# Altium schematic sheet ETHERNET.SchDoc
size A; SheetNumber: 10; SheetTotal: 10
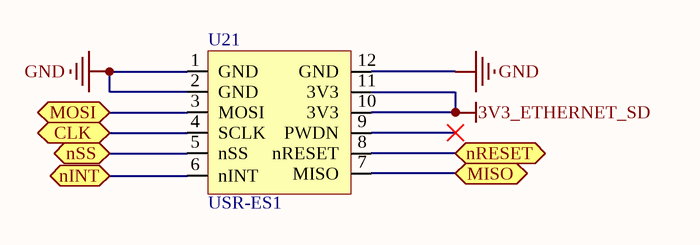
[diagram p0: ETHERNET.SchDoc]

## Parts
U21  USR-ES1  [USR-ES1]

## Ports
CLK (bidir), MISO (bidir), MOSI (bidir), nINT (bidir), nRESET (bidir), nSS (bidir)

## Nets
3V3_ETHERNET_SD: U21.10(3V3) U21.11(3V3)
GND: U21.1(GND) U21.2(GND) U21.12(GND)
CLK: U21.4(SCLK) ; port CLK
MISO: U21.7(MISO) ; port MISO
MOSI: U21.3(MOSI) ; port MOSI
nINT: U21.6(nINT) ; port nINT
nRESET: U21.8(nRESET) ; port nRESET
nSS: U21.5(nSS) ; port nSS

Not connected (* = marked no-connect by the designer): U21 9(PWDN)*

## Library data of the parts
U21 = USR-ES1: Ethernet module